# EAGLE schematic aku tolto (EAGLE 6.5.0)
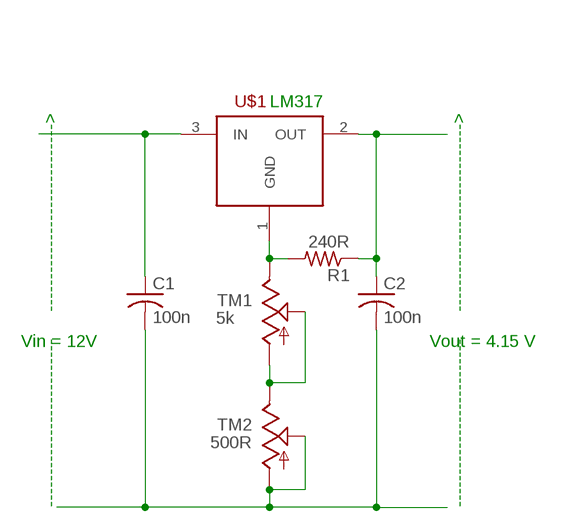
[diagram p0: schematic, sheet 1]

## Parts
C1  100n  C-US025_050-035X075  [C025_050-035X075]
C2  100n  C-US025_050-035X075  [C025_050-035X075]
R1  240R  R-US_0204/2V  [0204V]
TM1  5k  TRIM  [6MM]
TM2  500R  TRIM  [6MM]
U$1  LM317  [TO-220]

## Nets
N$1: C1.1 U$1.3(IN)
N$2: R1.2 TM1.E U$1.1(GND)
N$3: C1.2 C2.2 TM2.A TM2.S
N$4: C2.1 R1.1 U$1.2(OUT)
N$5: TM1.A TM1.S TM2.E

## Notes on the sheet
- LM317
- -----------------------------> | ----------------------------->
- Vin = 12V | Vout = 4.15 V
- -------------------------- | --------------------------

## Library data of the parts
C1 C2 = adafruit:C-US: CAPACITOR, American symbol
R1 = adafruit:R-US_: RESISTOR, American symbol
TM1 TM2 = adafruit:TRIM
U$1 = my_lib:LM317